# Altium schematic sheet DE-300617.SchDoc: USB Mifare Card Reader Writer
size A3; Author: eldar6776@hotmail.com; Organization: I-MEDIA GROUP d.o.o.; Address1: Topal Osman Paše 18; Address2: 71000 Sarajevo; Address3: Federacija BiH; Address4: Bosna i Hercegovina; DocumentNumber: DE-300617; Revision: 001; SheetNumber: 1; SheetTotal: 1
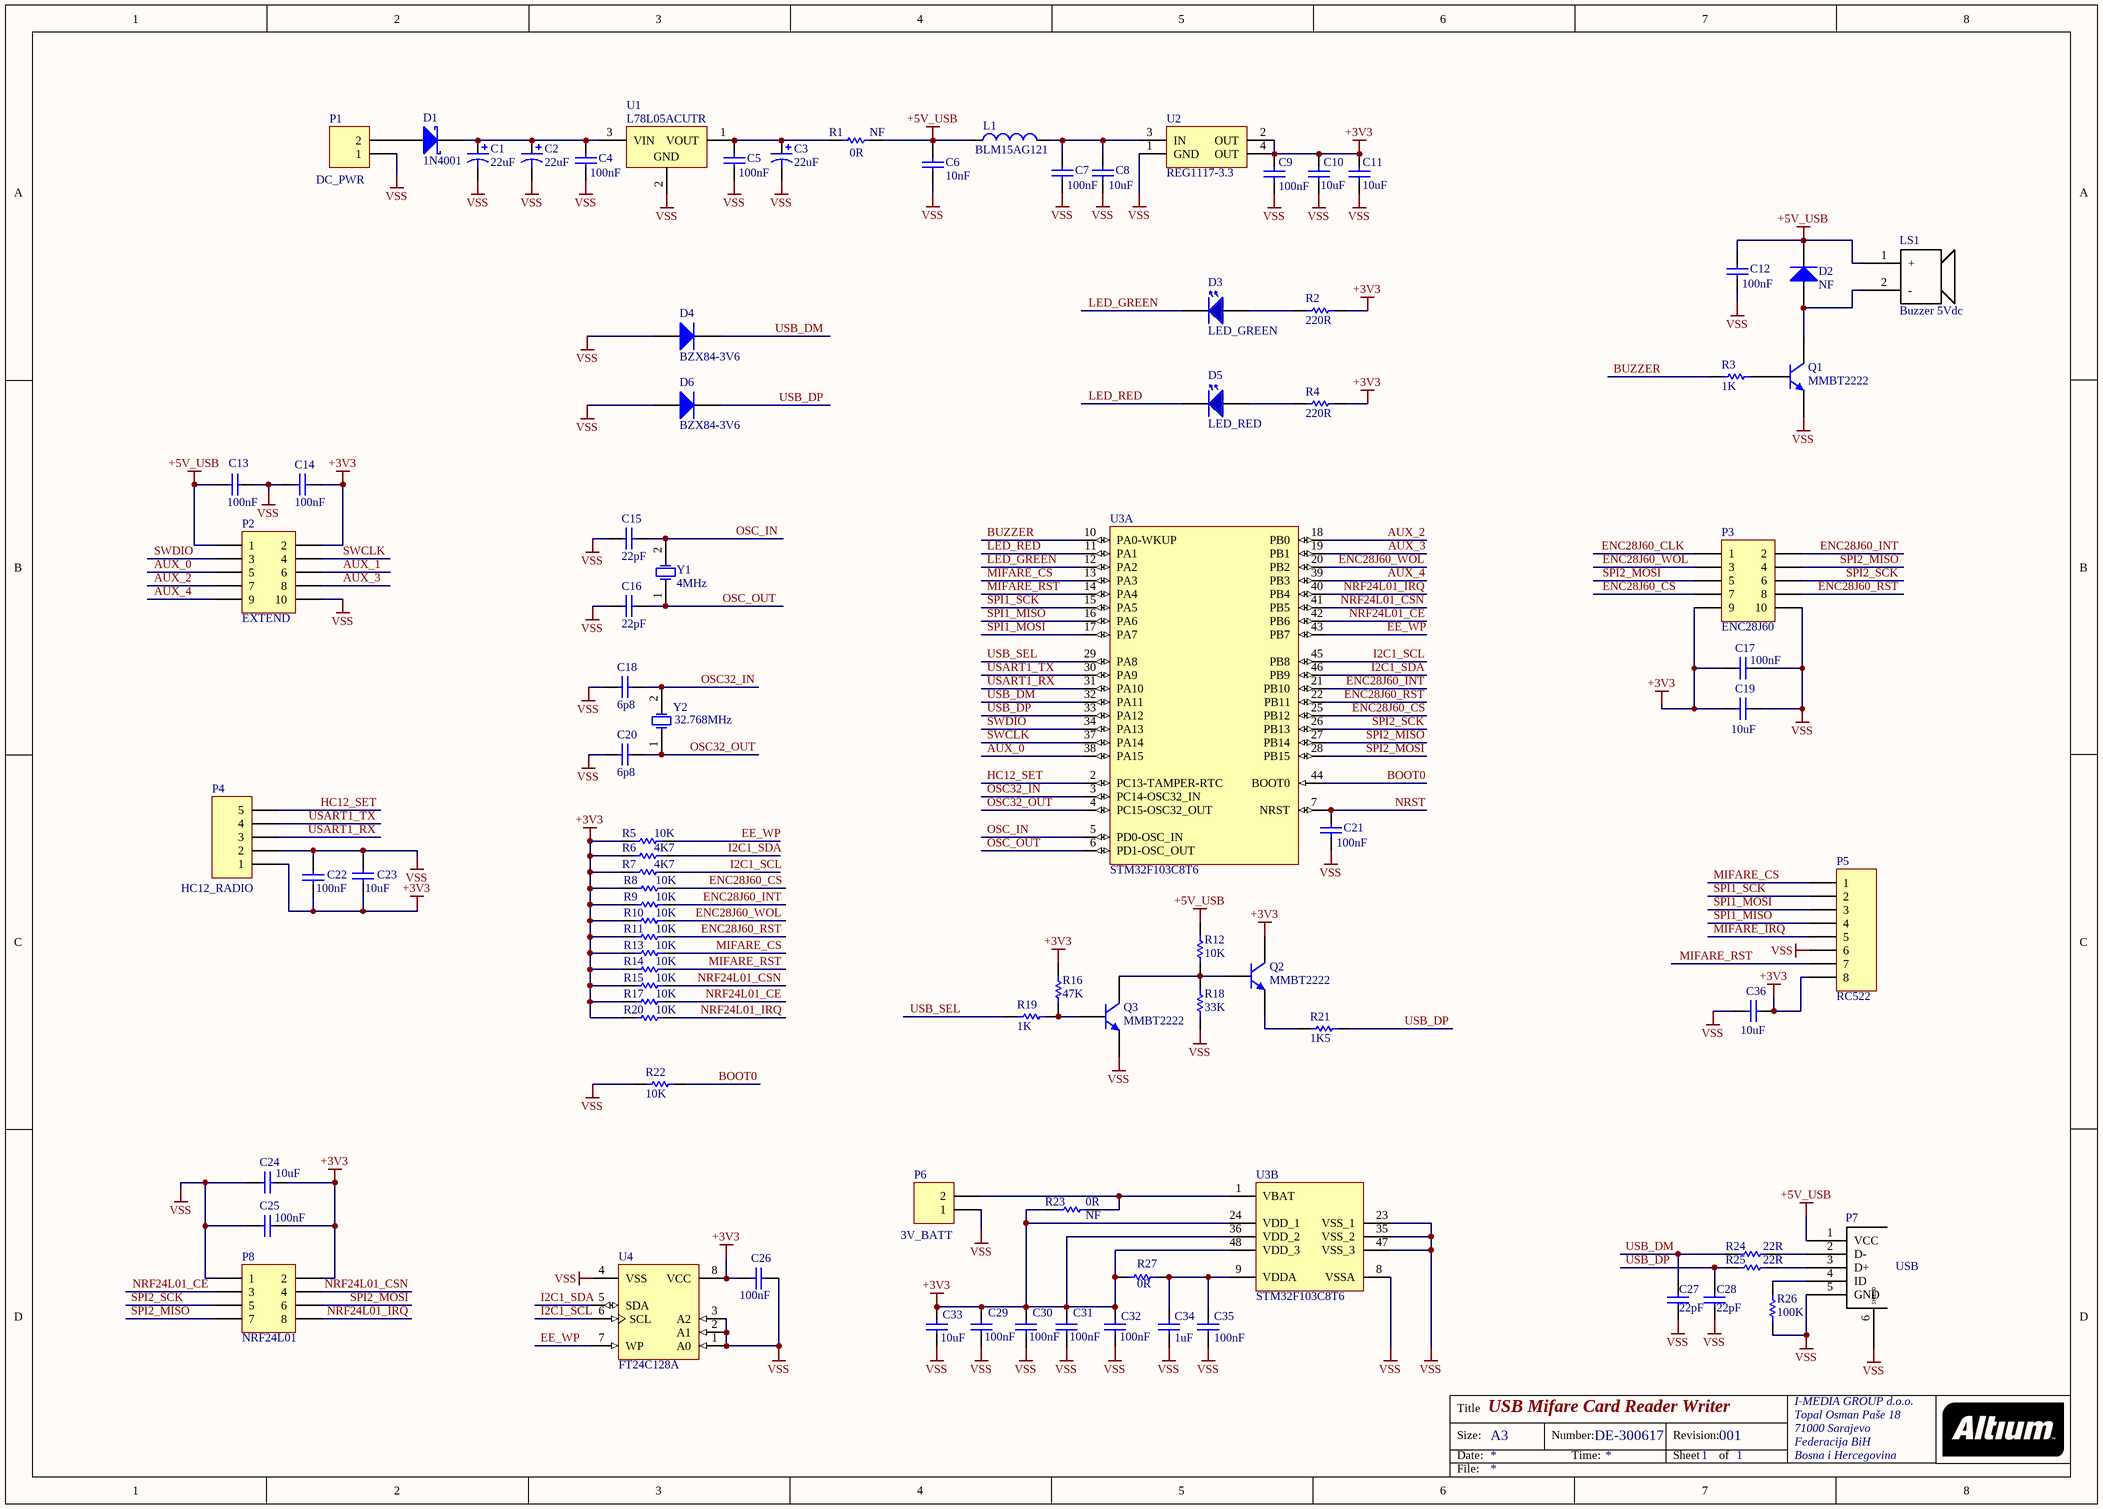
[diagram p0: DE-300617.SchDoc]

## Parts
C1  22uF  [F]
C2  22uF  [F]
C3  22uF  [F]
C4  100nF  [0603]
C5  100nF  [0603]
C6  10nF  [0603]
C7  100nF  [0603]
C8  value 10uF  [0805]
C9  100nF  [0603]
C10  value 10uF  [0805]
C11  value 10uF  [0805]
C12  100nF  [0603]
C13  100nF  [0603]
C14  100nF  [0603]
C15  22pF  [0603]
C16  22pF  [0603]
C17  value 100nF  [0805]
C18  6p8  [0603]
C19  value 10uF  [0805]
C20  6p8  [0603]
C21  100nF  [0603]
C22  value 100nF  [0805]
C23  value 10uF  [0805]
C24  value 10uF  [0805]
C25  value 100nF  [0805]
C26  100nF  [0603]
C27  22pF  [0603]
C28  22pF  [0603]
C29  100nF  [0603]
C30  100nF  [0603]
C31  100nF  [0603]
C32  100nF  [0603]
C33  value 10uF  [0805]  (hidden comment: 4u7)
C34  1uF  [0603]
C35  100nF  [0603]
C36  value 10uF  [0805]  (hidden comment: C0805)
D1  1N4001  [SMA]
D2  NF  [SOD323]
D3  LED_GREEN  [LED 3mm]
D4  BZX84-3V6  [SOT23_N]
D5  LED_RED  [LED 3mm]
D6  BZX84-3V6  [SOT23_N]
L1  BLM15AG121  [0402-A]
LS1  Buzzer 5Vdc  [BUZZER]
P1  DC_PWR  [HDR1X2]
P2  EXTEND  [HDR2X5]
P3  ENC28J60  [HDR2X5]
P4  HC12_RADIO  [HDR1X5]
P5  RC522  [HDR1X8]
P6  3V_BATT  [HDR1X2]
P7  USB  [USB mini B]
P8  NRF24L01  [HDR2X4]
Q1  MMBT2222  [SOT23_N]
Q2  MMBT2222  [SOT23_N]
Q3  MMBT2222  [SOT23_N]
R1  0R  value NF  [ERA-0603]
R2  220R  [ERA-0603]
R3  1K  [ERA-0603]
R4  220R  [ERA-0603]
R5  10K  [ERA-0603]
R6  4K7  [ERA-0603]
R7  4K7  [ERA-0603]
R8  10K  [ERA-0603]
R9  10K  [ERA-0603]
R10  10K  [ERA-0603]
R11  10K  [ERA-0603]
R12  10K  [ERA-0603]
R13  10K  [ERA-0603]
R14  10K  [ERA-0603]
R15  10K  [ERA-0603]
R16  47K  [ERA-0603]
R17  10K  [ERA-0603]
R18  33K  [ERA-0603]
R19  1K  [ERA-0603]
R20  10K  [ERA-0603]
R21  1K5  [ERA-0603]
R22  10K  [ERA-0603]
R23  0R  value NF  [ERA-0603]
R24  22R  [ERA-0603]
R25  22R  [ERA-0603]
R26  100K  [ERA-0603]
R27  0R  [ERA-0603]
U1  L78L05ACUTR  [SOT-89_N]
U2  REG1117-3.3  [ZZ311]
U3  STM32F103C8T6  [STM-LQFP48_N]  (parts A,B of 2)
U4  FT24C128A  [SOIC-SN8_N]
Y1  4MHz  [HC49/4H_SMX]
Y2  32.768MHz  [R26]

## Nets
+3V3: C9.2 C10.1 C11.1 C14.2 C17.1 C19.2 C22.1 C23.2 C24.1 C25.2 C26.1 C29.2 C30.2 C31.2 C32.2 C33.2 C36.2 P2.2 P3.9 P4.1 P5.8 P8.2 Q2.3(C) R2.1 R4.1 R5.2 R6.2 R7.2 R8.2 R9.2 R10.2 R11.2 R13.2 R14.2 R15.2 R16.1 R17.2 R20.2 R23.2 R27.2 U2.2(OUT) U2.4(OUT) U3.24(VDD_1) U3.36(VDD_2) U3.48(VDD_3) U4.8(VCC)
+5V_USB: C6.2 C12.2 C13.1 D2.1(K) L1.1 LS1.1(+) P2.1 P7.1(VCC) R1.1 R12.1
VSS: C1.2 C2.2 C3.2 C4.1 C5.1 C6.1 C7.1 C8.2 C9.1 C10.2 C11.2 C12.1 C13.2 C14.1 C15.2 C16.2 C17.2 C18.2 C19.1 C20.2 C21.2 C22.2 C23.1 C24.2 C25.1 C26.2 C27.1 C28.1 C29.1 C30.1 C31.1 C32.1 C33.1 C34.1 C35.1 C36.1 D4.1(A) D6.1(A) P1.1 P2.10 P3.10 P4.2 P5.6 P6.1 P7.5(GND) P7.6(SHIELD) P8.1 Q1.2(E) Q3.2(E) R18.2 R22.2 R26.1 U1.2(GND) U2.1(GND) U3.8(VSSA) U3.23(VSS_1) U3.35(VSS_2) U3.47(VSS_3) U4.1(A0) U4.2(A1) U4.3(A2)
AUX_0: P2.5 U3.38(PA15)
AUX_1: P2.6
AUX_2: P2.7 U3.18(PB0)
AUX_3: P2.8 U3.19(PB1)
AUX_4: P2.9 U3.39(PB3)
BOOT0: R22.1 U3.44(BOOT0)
BUZZER: R3.2 U3.10(PA0-WKUP)
EE_WP: R5.1 U3.43(PB7) U4.7(WP)
ENC28J60_CLK: P3.1
ENC28J60_CS: P3.7 R8.1 U3.25(PB12)
ENC28J60_INT: P3.2 R9.1 U3.21(PB10)
ENC28J60_RST: P3.8 R11.1 U3.22(PB11)
ENC28J60_WOL: P3.3 R10.1 U3.20(PB2)
HC12_SET: P4.5 U3.2(PC13-TAMPER-RTC)
I2C1_SCL: R7.1 U3.45(PB8) U4.6(SCL)
I2C1_SDA: R6.1 U3.46(PB9) U4.5(SDA)
LED_GREEN: D3.1 U3.12(PA2)
LED_RED: D5.1 U3.11(PA1)
MIFARE_CS: P5.1 R13.1 U3.13(PA3)
MIFARE_IRQ: P5.5
MIFARE_RST: P5.7 R14.1 U3.14(PA4)
NRF24L01_CE: P8.3 R17.1 U3.42(PB6)
NRF24L01_CSN: P8.4 R15.1 U3.41(PB5)
NRF24L01_IRQ: P8.8 R20.1 U3.40(PB4)
NRST: C21.1 U3.7(NRST)
OSC32_IN: C18.1 U3.3(PC14-OSC32_IN) Y2.2(OSC2)
OSC32_OUT: C20.1 U3.4(PC15-OSC32_OUT) Y2.1(OSC1)
OSC_IN: C15.1 U3.5(PD0-OSC_IN) Y1.2(OSC2)
OSC_OUT: C16.1 U3.6(PD1-OSC_OUT) Y1.1(OSC1)
SPI1_MISO: P5.4 U3.16(PA6)
SPI1_MOSI: P5.3 U3.17(PA7)
SPI1_SCK: P5.2 U3.15(PA5)
SPI2_MISO: P3.4 P8.7 U3.27(PB14)
SPI2_MOSI: P3.5 P8.6 U3.28(PB15)
SPI2_SCK: P3.6 P8.5 U3.26(PB13)
SWCLK: P2.4 U3.37(PA14)
SWDIO: P2.3 U3.34(PA13)
USART1_RX: P4.3 U3.31(PA10)
USART1_TX: P4.4 U3.30(PA9)
USB_DM: C27.2 D4.3(K) R24.1 U3.32(PA11)
USB_DP: C28.2 D6.3(K) R21.1 R25.1 U3.33(PA12)
USB_SEL: R19.1 U3.29(PA8)
NetC1_1: C1.1 C2.1 C4.2 D1.2(K) U1.3(VIN)
NetC3_1: C3.1 C5.2 R1.2 U1.1(VOUT)
NetC7_2: C7.2 C8.1 L1.2 U2.3(IN)
NetC34_2: C34.2 C35.2 R27.1 U3.9(VDDA)
NetD1_1: D1.1(A) P1.2
NetD2_2: D2.2(A) LS1.2(-) Q1.3(C)
NetD3_2: D3.2 R2.2
NetD5_2: D5.2 R4.2
NetP6_2: P6.2 R23.1 U3.1(VBAT)
NetP7_2: P7.2(D-) R24.2
NetP7_3: P7.3(D+) R25.2
NetP7_4: P7.4(ID) R26.2
NetQ1_1: Q1.1(B) R3.1
NetQ2_1: Q2.1(B) Q3.3(C) R12.2 R18.1
NetQ2_2: Q2.2(E) R21.2
NetQ3_1: Q3.1(B) R16.2 R19.2

Not connected (* = marked no-connect by the designer): U4 4(VSS)

## Notes on the sheet
- Labels drawn without touching a wire or pin: VSS
- Title
- Size:
- Date:
- A3
- Number:
- Time:
- Revision:
- Sheet
- of
- File:

## Library data of the parts
C1-C3 = 194D226X0015F2: Midget Conformal Coated Solid Tantalum Chip Capacitor: 22uF, 20% Tolerance, 15 WVDC @ +85°C, Surge = 20V; Note: See Data Sheet for full range of components; Published: 19-Mar-2004; DatasheetDocument: 05-Jul-2002; PackageReference: F; Publisher: Altium Limited; ComponentLink1Description: Manufacturer Link; ComponentLink1URL: http://www.vishay.com/; ComponentLink2Description: Datasheet; ComponentLink2URL: http://www.vishay.com/docs/40000/194d.pdf; Value: 22uF
C4-C7 C9 C12-C16 C18 C20 C21 C26-C32 C34 C35 = C0603: Ceramic Chip Capacitor - Standard; Note: Footprint corresponds to dimensions for bulk cassette packaging. This case size has tightened tolerances.; Published: 17-Jul-2002; LatestRevisionDate: 19-Mar-2004; LatestRevisionNote: Silkscreen size reduced.; DatasheetDocument: Mar-2001; PackageDocument: Mar-2001; PackageReference: 0603; Publisher: Altium Limited; Code_JEITA: 0603; Code_IPC: 1608 [0603]; ComponentLink1Description: Manufacturer Link; ComponentLink1URL: http://www.kemet.com/; ComponentLink2Description: Datasheet; ComponentLink2URL: http://www.kemet.com/kemet/web/homepage/kechome.nsf/vapubfilesname/F3102TA.pdf/$file/F3102TA.pdf
  C21 C26 C35: Value: 100nF
  C34: Value: 1uF
C8 C10 C11 C17 C19 C22-C25 C33 C36 = C0805: Ceramic Chip Capacitor - Standard; Note: Footprint corresponds to dimensions for bulk cassette packaging. This case size has tightened tolerances.; Published: 17-Jul-2002; LatestRevisionDate: 19-Mar-2004; LatestRevisionNote: Silkscreen size reduced.; DatasheetDocument: Mar-2001; PackageDocument: Mar-2001; PackageReference: 0805; Publisher: Altium Limited; Code_JEITA: 0805; Code_IPC: 2012[0805]; ComponentLink1Description: Manufacturer Link; ComponentLink1URL: http://www.kemet.com/; ComponentLink2Description: Datasheet; ComponentLink2URL: http://www.kemet.com/kemet/web/homepage/kechome.nsf/vapubfilesname/F3102TA.pdf/$file/F3102TA.pdf
D1 = 10MQ060N: Schottky Rectifier; Published: 17-Sep-2003; DatasheetVersion: May-2002; PackageVersion: revH, May-2002; PackageReference: SMA; Publisher: Altium Limited; PackageDescription: DO-214-AC/SMA; 2 C-Bend Leads; Body 5 x 2.7 mm, inc. leads (LxW); ComponentLink1Description: Manufacturer Link; ComponentLink1URL: http://www.irf.com/; ComponentLink2Description: Datasheet; ComponentLink2URL: http://www.irf.com/product-info/datasheets/data/10MQ060N.pdf
D2 = BAS321: General-purpose Diode; Published: 17-Sep-2003; LatestRevisionDate: 19-Mar-2004; LatestRevisionNote: Silkscreen size reduced.; DatasheetVersion: 9-Feb-1999; PackageVersion: May-1999; PackageReference: SOD323; Publisher: Altium Limited; PackageDescription: SOD-323/SC-76; 2 Leads; Body 1.7 x 1.3 mm, (LxW); ComponentLink1Description: Manufacturer Link; ComponentLink1URL: http://www.semiconductors.philips.com/; ComponentLink2Description: Datasheet; ComponentLink2URL: http://www.semiconductors.philips.com/acrobat/datasheets/BAS321_2.pdf
D3 D5 = LED 3mm
D4 D6 = BZX84-A4V7: Voltage Regulator Diode; Note: Pin 2 is not connected and not drawn; Published: 17-Sep-2003; LatestRevisionDate: 12-Dec-2006; LatestRevisionNote: IPC-7351 Footprint Added.; DatasheetVersion: 18-May-1999; PackageVersion: May-1999; PackageReference: SOT23; Publisher: Altium Limited; PackageDescription: 3-Pin SOT-23 Package 0.95 mm Pitch, 2.3 mm Lead Span; ComponentLink1Description: Manufacturer Link; ComponentLink1URL: http://www.semiconductors.philips.com/; ComponentLink2Description: Datasheet; ComponentLink2URL: http://www.semiconductors.philips.com/acrobat/datasheets/BZX84_SERIES_3.pdf
L1 = Chip inductor: SMD chip inductor; Code_IEC: 1005; Published: 8-Jun-2000; LatestRevisionDate: 29-May-2009; LatestRevisionNote: IPC-7351 Footprint Added.; PackageReference: 0402-A; Publisher: Altium Limited; PackageDescription: Chip Inductor; Code_JEITA: 0402
LS1 = BUZZER: 5Vdc PCB buzzer
P1 P6 = Header 2: Header, 2-Pin; LatestRevisionDate: 17-Jul-2002; LatestRevisionNote: Re-released for DXP Platform.; Publisher: Altium Limited
P2 P3 = Header 5X2: Header, 5-Pin, Dual row; LatestRevisionDate: 17-Jul-2002; LatestRevisionNote: Re-released for DXP Platform.; Publisher: Altium Limited
P4 = Header 5: Header, 5-Pin; LatestRevisionDate: 17-Jul-2002; LatestRevisionNote: Re-released for DXP Platform.; Publisher: Altium Limited
P5 = Header 8: Header, 8-Pin; LatestRevisionDate: 17-Jul-2002; LatestRevisionNote: Re-released for DXP Platform.; Publisher: Altium Limited
P7 = USB mini B: USB connector B mini
P8 = Header 4X2: Header, 4-Pin, Dual row; LatestRevisionDate: 17-Jul-2002; LatestRevisionNote: Re-released for DXP Platform.; Publisher: Altium Limited
Q1-Q3 = BC817: NPN General-purpose Transistor; Published: 17-Sep-2003; LatestRevisionDate: 12-Dec-2006; LatestRevisionNote: IPC-7351 Footprint Added.; DatasheetVersion: Jun-1999; PackageVersion: May-1999; PackageReference: SOT23; Publisher: Altium Limited; PackageDescription: 3-Pin SOT-23 Package 0.95 mm Pitch, 2.3 mm Lead Span; ComponentLink1Description: Manufacturer Link; ComponentLink1URL: http://www.semiconductors.philips.com/; ComponentLink2Description: Datasheet; ComponentLink2URL: http://www.semiconductors.philips.com/acrobat/datasheets/BC817_BC817W_BC337_5.pdf
R1-R23 R27 = ERAV: Metal Film Thermosensitive Chip Resistor, 0.56 Ohm to 10k Ohm Range, 5% Tolerance, 0603 Size, 0.063 W; Note: If flow soldering, adjust pad width of PCB Footprint to 0.7 - 0.8 times the width of the resistor.; Published: 17-Dec-2003; LatestRevisionDate: 19-Mar-2004; LatestRevisionNote: Silkscreen size reduced.; PackageDocument: Mar-2003; PackageReference: ERA-0603; Publisher: Altium Limited; Code_IPC: 1608 [0603]; ComponentLink1Description: Manufacturer Link; ComponentLink1URL: http://www.panasonic.com/industrial/components/resistive_products.htm; ComponentLink2Description: Datasheet; ComponentLink2URL: http://www.panasonic.com/industrial/components/pdf/AOF0000CE1.pdf
R24-R26 = ERA3Y: Rectangular Thick Film Chip Resistor, 10 Ohm to 330k Ohm Range, 0.1% and 0.5% Tolerance, 0603 Size, 0.063 W; Note: If flow soldering, adjust pad width of PCB Footprint to 0.7 - 0.8 times the width of the resistor.; Published: 17-Dec-2003; LatestRevisionDate: 19-Mar-2004; LatestRevisionNote: Silkscreen size reduced.; PackageDocument: Mar-2003; PackageReference: ERA-0603; Publisher: Altium Limited; Code_IPC: 1608 [0603]; ComponentLink1Description: Manufacturer Link; ComponentLink1URL: http://www.panasonic.com/industrial/components/resistive_products.htm; ComponentLink2Description: Datasheet; ComponentLink2URL: http://www.panasonic.com/industrial/components/pdf/AOA0000CE8.pdf
U1 = L78L05ACUTR: Positive Voltage Regulator, 5V, 4-Pin SOT-89, Tape and Reel; DatasheetVersion: Feb-2011; PackageVersion: 2011; PackageReference: SOT-89; PackageDescription: 3-Pin SOT-89 Package 1.5 mm Pitch, 4.1 mm Lead Span; PartNumber: L78L05ACUTR; ComponentLink1Description: Manufacturer URL; ComponentLink1URL: http://www.st.com; ComponentLink2Description: Datasheet; ComponentLink2URL: http://www.st.com/internet/com/TECHNICAL_RESOURCES/TECHNICAL_LITERATURE/DATASHEET/CD00000446.pdf
U2 = REG1117-3.3: 800mA and 1A Low Dropout Positive Regulator 2.85V, 3.3V, 5V, and Adjustable; Published: 8-Jun-2000; LatestRevisionDate: 17-Jul-2002; LatestRevisionNote: Re-released for DXP Platform.; DatasheetVersion: Sep-1997; PackageVersion: revC; PackageReference: ZZ311; Publisher: Altium Limited; PackageDescription: SOT-223/SC-73; 4 Leads; Body 6.7 x 7.3 mm, inc. leads (LxW max); ComponentLink1Description: Manufacturer Link; ComponentLink1URL: http://www.ti.com/; ComponentLink2Description: Datasheet; ComponentLink2URL: http://www-s.ti.com/sc/ds/REG1117.pdf
U3 = STM32F103C8T6: ARM Cortex-M3 32-bit MCU, 64 KB Flash, 20 KB Internal RAM, 37 I/Os, 48-pin LQFP, -40 to 85 degC, Tray; A/D Converter: 2x12-bit (10 Channel); FLASH Size (Prog) (kB): 64; I/Os (High Current): 37; Internal RAM Size (kB): 20; Operating Frequency(F) (Processor speed) (MHz): 72; Supply Voltage(Vcc) min (V): 2; DatasheetVersion: Rev. 16; PackageVersion: Rev. 6, 06/2013; PackageReference: LQFP48; PackageDescription: 48-Pin Low Profile Quad Flat Package, 7 x 7 mm Body, 0.5 mm Pitch; Supplier 1: Digi-Key; Supplier Part Number 1: 497-6063-ND; Supplier 2: Farnell; Supplier Part Number 2: 1447637; Supplier 3: Newark; Supplier Part Number 3: 59M2182; Supplier 4: Newark; Supplier Part Number 4: 57P1222; Supplier 5: Mouser; Supplier Part Number 5: 511-STM32F103C8T6; Core: ARM Cortex-M3; Packing: Tray; Mounting Technology: Surface Mount; PartNumber: STM32F103C8T6; ComponentLink1Description: Manufacturer URL; ComponentLink1URL: http://www.st.com/web/en/home.html; ComponentLink2Description: Datasheet; ComponentLink2URL: http://www.st.com/st-web-ui/static/active/en/resource/technical/document/datasheet/CD00161566.pdf; ComponentLink3Description: Package Specification; ComponentLink3URL: http://www.st.com/st-web-ui/static/active/en/resource/technical/document/datasheet/DM00058181.pdf
U4 = 24AA64/SN: 64Kbit, 400kHz, 1.7V, I2C Serial EEPROM, 8-Pin SOIC 150mil, Commercial Temperature; Published: 29-Jan-2009; DatasheetVersion: revQ, Jun-2009; PackageVersion: revBB, Aug-2009; PackageReference: SOIC-SN8; Publisher: Altium Limited; PackageDescription: 8-Lead Plastic Small Outline (SN) - Narrow, 3.90mm Body [SOIC]; Supplier 1: Digi-Key; Supplier Part Number 1: 24AA64/SN-ND; Code_JEDEC: MS-012; Code_IPC: SOIC127P600-8; ComponentLink1Description: Datasheet; ComponentLink1URL: http://ww1.microchip.com/downloads/en/DeviceDoc/21189Q.pdf; ComponentLink2Description: Packaging Specification; ComponentLink2URL: http://www.microchip.com/stellent/groups/techpub_sg/documents/packagingspec/en012702.pdf; ComponentLink3Description: Microchip.com Home; ComponentLink3URL: http://www.microchip.com/
Y1 = HC49/4H_SMX: Surface Mount Quartz Crystal; Note: PCB layout complies with manufacturer's recommendation.; Published: 17-Jul-2002; DatasheetDocument: 18-Oct-1999; PackageDocument: 18-Oct-1999; PackageReference: HC49/4H_SMX; Publisher: Altium Limited; ComponentLink1Description: Manufacturer Link; ComponentLink1URL: http://www.cmac.com/mt/; ComponentLink2Description: Datasheet; ComponentLink2URL: http://www.cmac.com/mt/databook/crystals/smd/hc49_4h_smx.pdf
Y2 = R26-32.768: Tuning Fork Crystal Unit; Published: 8-Jun-2000; LatestRevisionDate: 17-Jul-2002; LatestRevisionNote: Re-released for DXP Platform.; DatasheetDocument: 28-Sep-1998; PackageReference: R26; Publisher: Altium Limited; ComponentLink1Description: Manufacturer Link; ComponentLink1URL: http://www.raltron.com/products/microcrystals/default.asp; ComponentLink2Description: Datasheet; ComponentLink2URL: http://www.raltron.com/products/pdfspecs/crystal_r38_26_145.pdf